# EAGLE schematic FM radio Xmit (EAGLE 6.4)
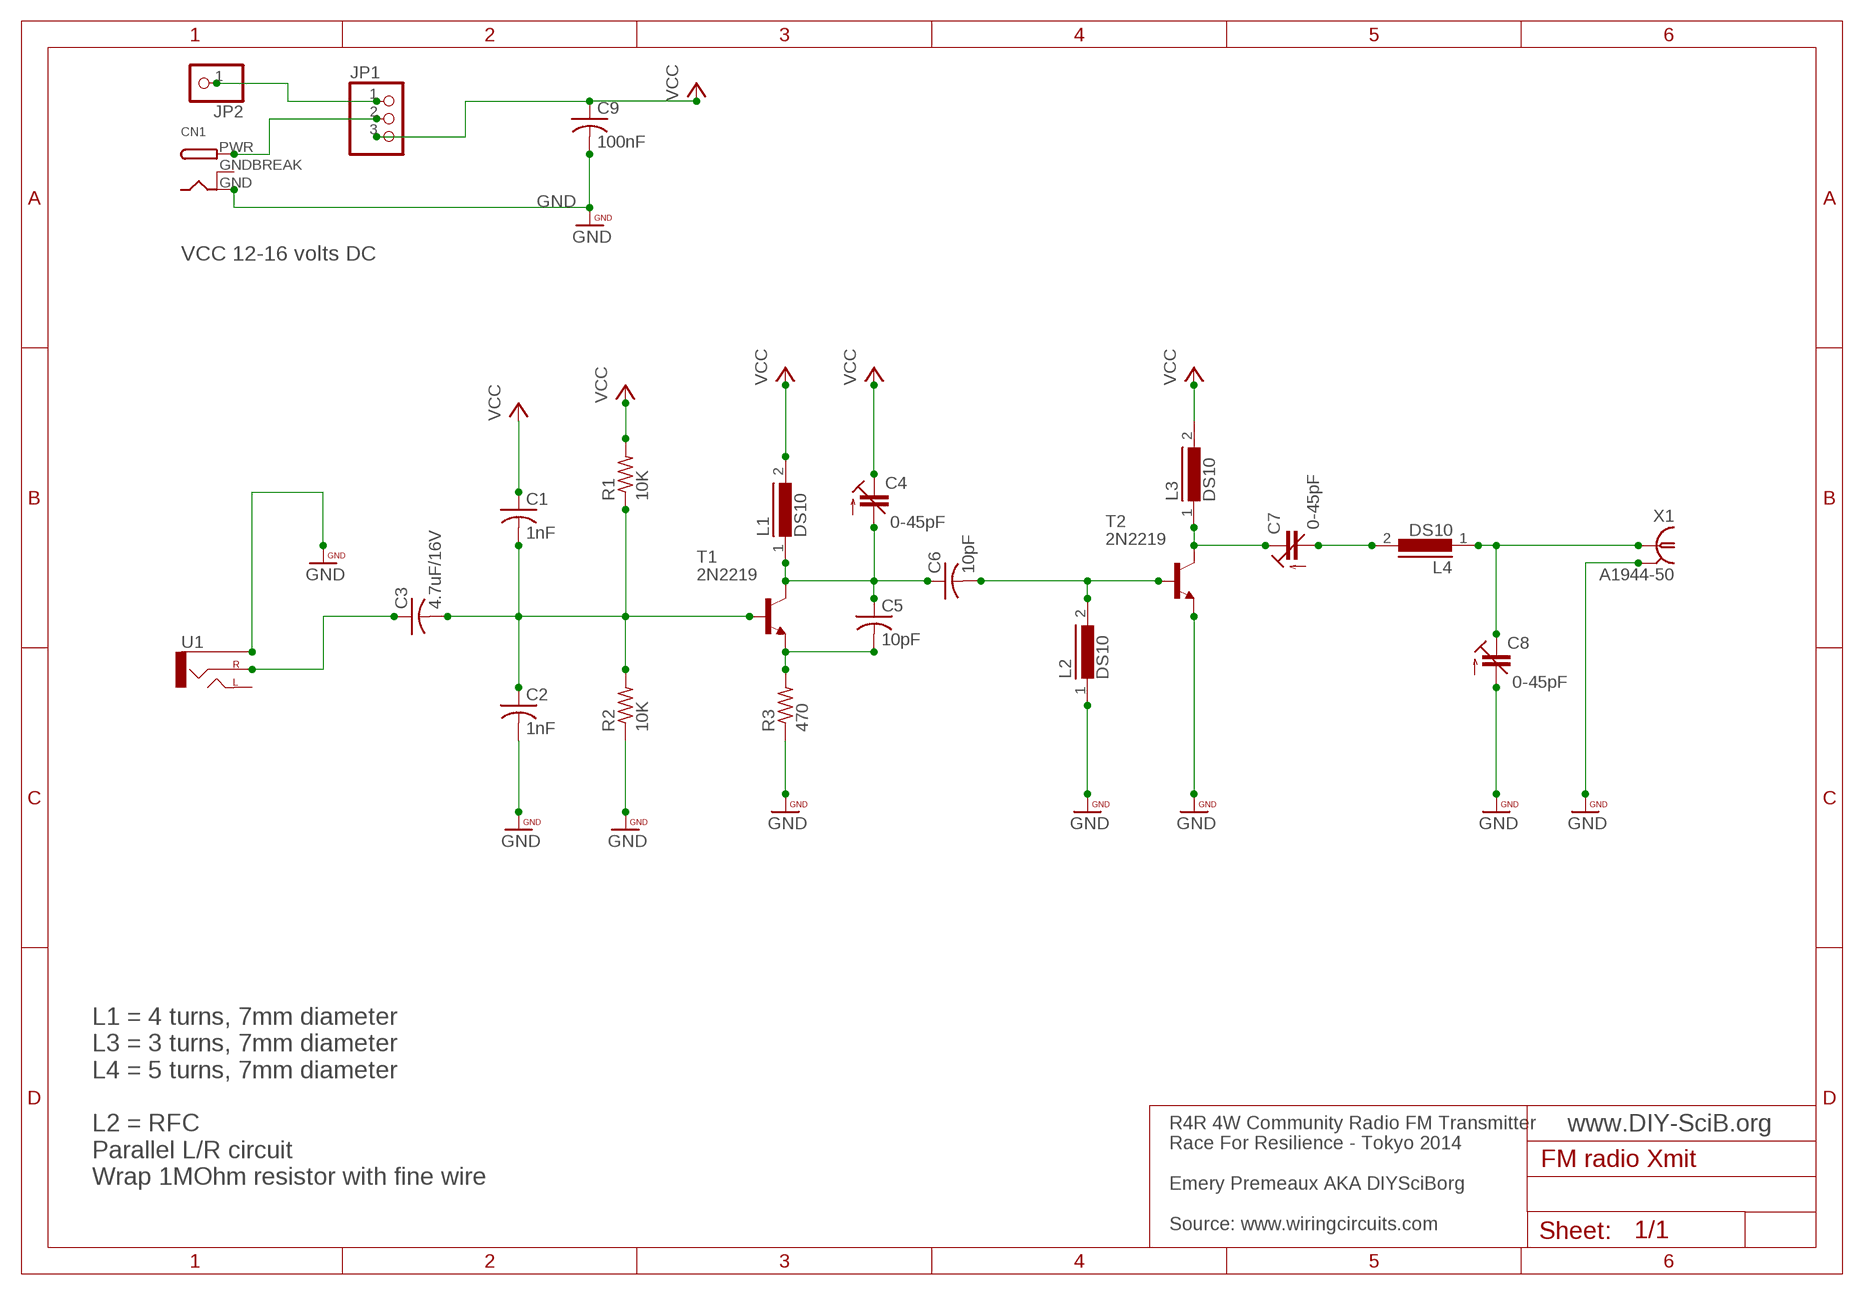
[diagram p0: schematic, sheet 1]

## Parts
C1  1nF  C-US025-024X044  [C025-024X044]
C2  1nF  C-US025-024X044  [C025-024X044]
C3  4.7uF/16V  C-US025-024X044  [C025-024X044]
C4  0-45pF  C-TRIMM3008  [3008]
C5  10pF  C-US025-024X044  [C025-024X044]
C6  10pF  C-US025-024X044  [C025-024X044]
C7  0-45pF  C-TRIMM3008  [3008]
C8  0-45pF  C-TRIMM3008  [3008]
C9  100nF  C-US025-024X044  [C025-024X044]
CN1  DCBARRELPTH  [DCJACK_2MM_PTH]
JP1  PINHD-1X3  [1X03]
JP2  PINHD-1X1  [1X01]
L1  DS10  [DS10]
L2  DS10  [DS10]
L3  DS10  [DS10]
L4  DS10  [DS10]
R1  10K  R-US_0204/7  [0204/7]
R2  10K  R-US_0204/7  [0204/7]
R3  470  R-US_0204/7  [0204/7]
T1  2N2219  [TO5]
T2  2N2219  [TO5]
U1  AUDIO-JACK2.5MM  [STEREOJACK2.5MM_STEREOJACK2.5MM]
X1  A1944-50  [A1944]

## Nets
GND: C2.2 C8.-(A) C9.2 CN1.GND L2.1 R2.1 R3.1 T2.1(E) U1.RING1(SLEEVE) X1.2 X1.3 X1.4 X1.5
N$1: C1.2 C2.1 C3.2 R1.1 R2.2 T1.2(B)
N$4: C7.+(E) L3.1 T2.3(C)
N$5: C3.1 U1.TIP(RIGHT)
N$7: C5.2 R3.2 T1.1(E)
N$11: C6.2 L2.2 T2.2(B)
N$16: C4.-(A) C5.1 C6.1 L1.1 T1.3(C)
N$21: C7.-(A) L4.2
N$23: C8.+(E) L4.1 X1.1
N$45: JP1.1 JP2.1
PWR: CN1.PWR JP1.2
VCC: C1.1 C4.+(E) C9.1 JP1.3 L1.2 R1.2
X: L3.2 ; supply symbol labelled VCC
Unconnected: U1.SHIELD(LEFT)

## Notes on the sheet
- VCC 12-16 volts DC
- www.DIY-SciB.org
- L1 = 4 turns, 7mm diameter
  L3 = 3 turns, 7mm diameter
  L4 = 5 turns, 7mm diameter
  
  L2 = RFC
  Parallel L/R circuit
  Wrap 1MOhm resistor with fine wire
- R4R 4W Community Radio FM Transmitter
  Race For Resilience - Tokyo 2014
  
  Emery Premeaux AKA DIYSciBorg
  
  Source: www.wiringcircuits.com

## Power pins joined to a net without a drawn wire
GNDBREAK: CN1.GNDBREAK

## Library data of the parts
C1-C3 C5 C6 C9 = adafruit:C-US: CAPACITOR, American symbol
C4 C7 C8 = c-trimm:C-TRIMM: Trimm capacitor; OC_FARNELL: unknown; OC_NEWARK: unknown
CN1 = adafruit:DCBARREL: 2.0mm DC Barrel Jack DCJACK_2MM_PTH - Through Hole Jack (4UConnector: 05537)
JP1 = adafruit:PINHD-1X3: PIN HEADER
JP2 = adafruit:PINHD-1X1: Pin header 1x1 for 0.1" spacing With round pins
L1-L4 = inductors:DS10: INDUCTOR
R1-R3 = adafruit:R-US_: RESISTOR, American symbol
T1 T2 = transistor:2N2219: NPN TRANSISTOR
U1 = SparkFun-Connectors:AUDIO-JACK: 3.5mm Audio Jack Simple 3.5mm common PCB mount audio jack. SKU: PRT-08032
X1 = con-coax:A1944-50: BNC CONNECTOR 50 Ohm distributor Buerklin 78F2475; OC_FARNELL: unknown; OC_NEWARK: unknown